# EAGLE design Atmega2560 (EAGLE 6.4)
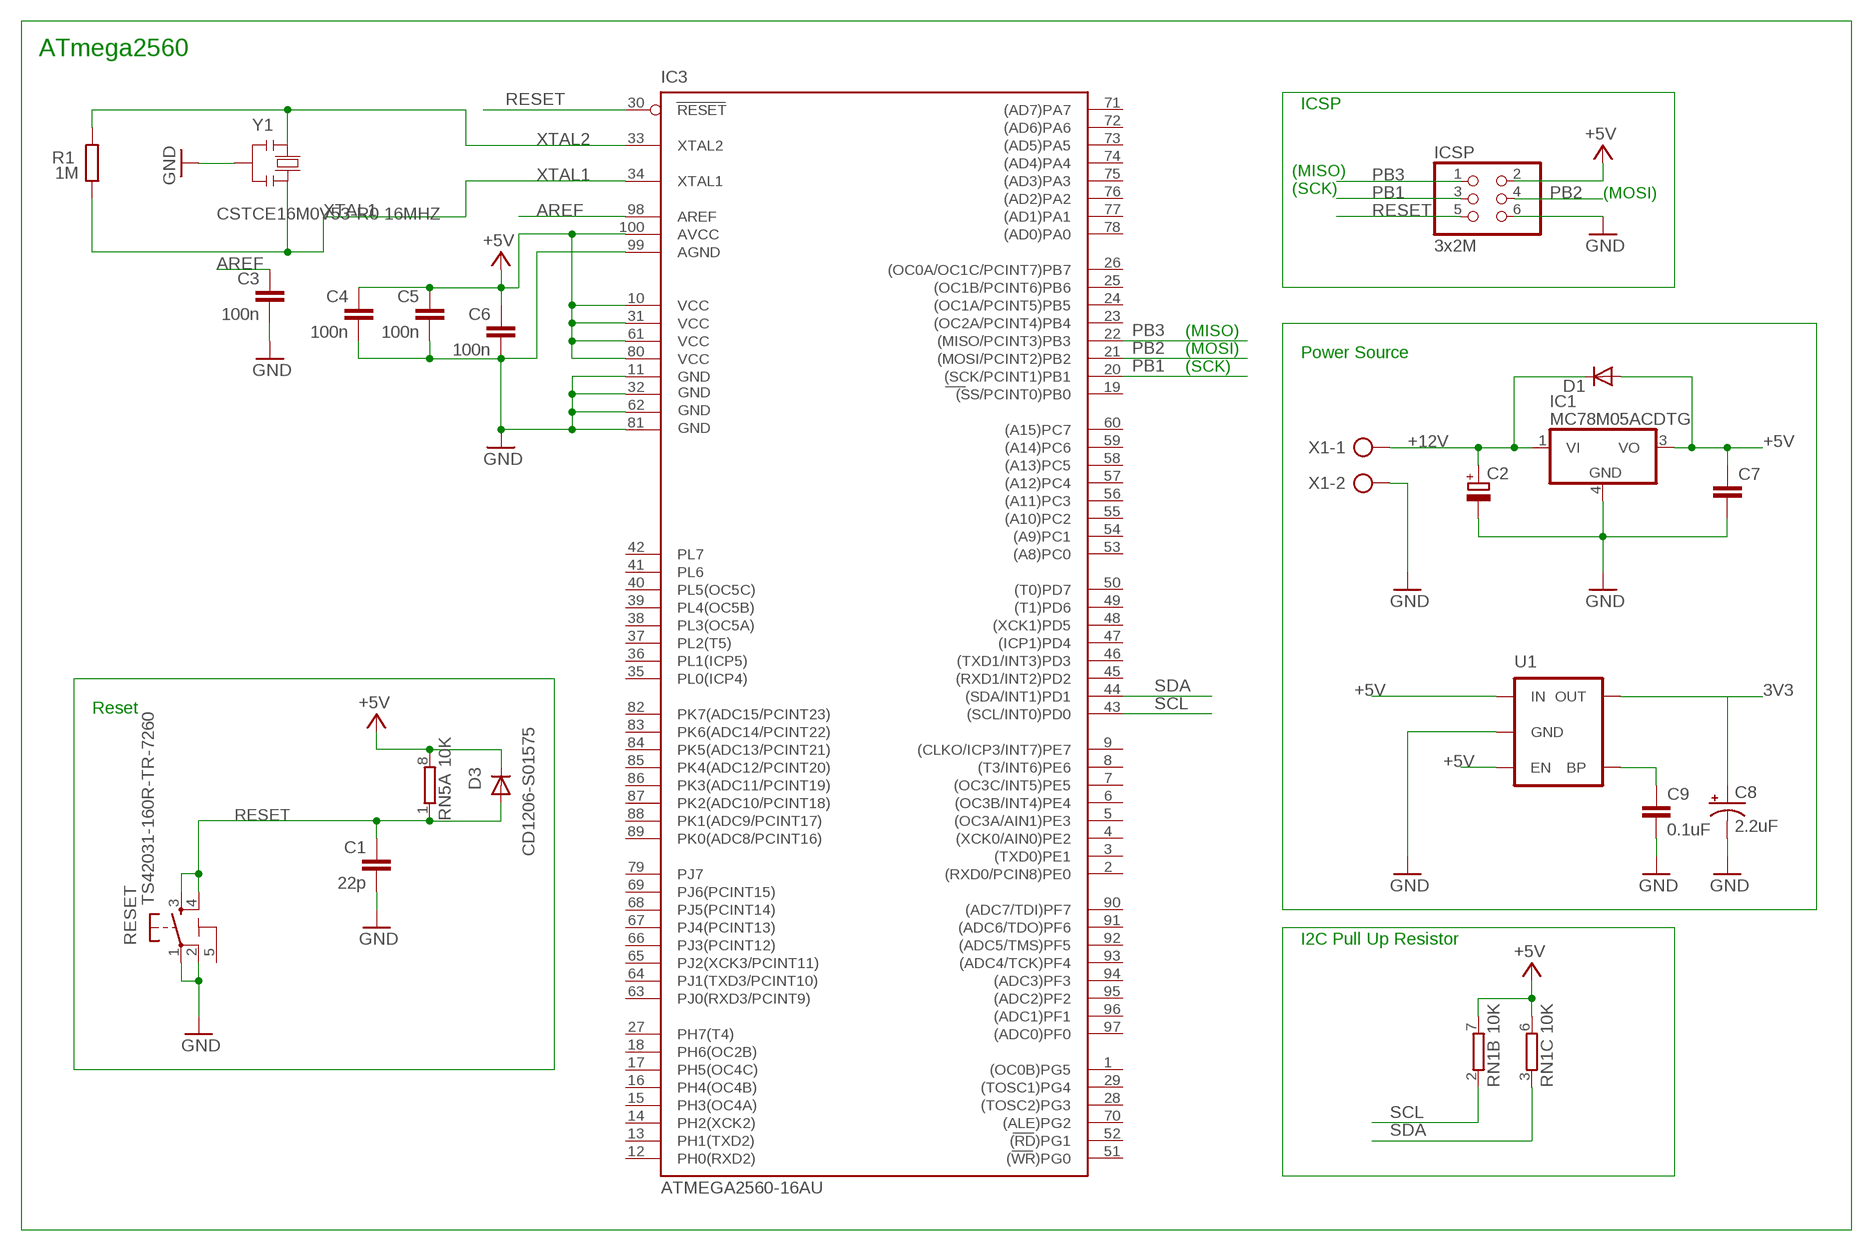
[diagram p0: schematic, sheet 1]

## Parts
C1  22p  C-EU0603-RND  [C0603-ROUND]
C2  CPOL-EUE5-13  [E5-13]
C3  100n  C-EU0603-RND  [C0603-ROUND]
C4  100n  C-EU0603-RND  [C0603-ROUND]
C5  100n  C-EU0603-RND  [C0603-ROUND]
C6  100n  C-EU0603-RND  [C0603-ROUND]
C7  CAPPTH  [CAP-PTH-SMALL]
C8  2.2uF  10UF-TANT  [EIA3216]
C9  0.1uF  0.1UF-25V(+80/-20%)(0603)  [0402-CAP]
D1  DIODESMA-KIT  [SMA-DIODE-KIT]
D3  CD1206-S01575  DIODE-MINIMELF  [MINIMELF]
IC1  MC78M05ACDTG  [DPACK_3]
IC3  ATMEGA2560-16AU  ATMEGA25602560-16AU  [TQFP100]
ICSP  3x2M  PINHD-2X3  [2X03]
R1  1M  R-EU_R0603  [R0603-ROUND]
RESET  TS42031-160R-TR-7260  TS42  [TS42]
RN1  10K  4R-NCAT16  [CAT16]
RN5  10K  4R-NCAT16  [CAT16]
U1  MIC52053.3V  [SOT23-5]
X1  AK500/2  [AK500/2]
Y1  CSTCE16M0V53-R0 16MHZ  RESONATORMU  [RESONATOR]

## Nets
3V3: C8.A(+) U1.5(OUT)
+5V [power usb]: C4.1 C5.1 C6.1 C7.1 D1.A D3.C IC1.3(VO) IC3.10(VCC) IC3.31(VCC1) IC3.61(VCC2) IC3.80(VCC3) IC3.100(AVCC) ICSP.2 RN1.6 RN1.7 RN5.8 U1.1(IN) U1.3(EN)
+12V: C2.+ D1.C IC1.1(VI) X1.1
AREF: C3.1 IC3.98(AREF)
GND [gnd]: C1.2 C2.- C3.2 C4.2 C5.2 C6.2 C7.2 C8.C(-) C9.2 IC1.4(GND) IC3.11(GND) IC3.32(GND1) IC3.62(GND2) IC3.81(GND3) IC3.99(AGND) ICSP.6 RESET.1 RESET.2 U1.2(GND) X1.2 Y1.2
N$5: C9.1 U1.4(BP)
PB1: IC3.20((SCK/PCINT1)PB1) ICSP.3
PB2: IC3.21((MOSI/PCINT2)PB2) ICSP.4
PB3: IC3.22((MISO/PCINT3)PB3) ICSP.1
RESET: C1.1 D3.A IC3.30(RESET) ICSP.5 RESET.3 RESET.4 RN5.1
SCL: IC3.43((SCL/INT0)PD0) RN1.2
SDA: IC3.44((SDA/INT1)PD1) RN1.3
XTAL1: IC3.34(XTAL1) R1.1 Y1.3
XTAL2: IC3.33(XTAL2) R1.2 Y1.1
Unconnected: IC3.1((OC0B)PG5) IC3.2((RXD0/PCIN8)PE0) IC3.3((TXD0)PE1) IC3.4((XCK0/AIN0)PE2) IC3.5((OC3A/AIN1)PE3) IC3.6((OC3B/INT4)PE4) IC3.7((OC3C/INT5)PE5) IC3.8((T3/INT6)PE6) IC3.9((CLKO/ICP3/INT7)PE7) IC3.12(PH0(RXD2)) IC3.13(PH1(TXD2)) IC3.14(PH2(XCK2)) IC3.15(PH3(OC4A)) IC3.16(PH4(OC4B)) IC3.17(PH5(OC4C)) IC3.18(PH6(OC2B)) IC3.19((SS/PCINT0)PB0) IC3.23((OC2A/PCINT4)PB4) IC3.24((OC1A/PCINT5)PB5) IC3.25((OC1B/PCINT6)PB6) IC3.26((OC0A/OC1C/PCINT7)PB7) IC3.27(PH7(T4)) IC3.28((TOSC2)PG3) IC3.29((TOSC1)PG4) IC3.35(PL0(ICP4)) IC3.36(PL1(ICP5)) IC3.37(PL2(T5)) IC3.38(PL3(OC5A)) IC3.39(PL4(OC5B)) IC3.40(PL5(OC5C)) IC3.41(PL6) IC3.42(PL7) IC3.45((RXD1/INT2)PD2) IC3.46((TXD1/INT3)PD3) IC3.47((ICP1)PD4) IC3.48((XCK1)PD5) IC3.49((T1)PD6) IC3.50((T0)PD7) IC3.51((WR)PG0) IC3.52((RD)PG1) IC3.53((A8)PC0) IC3.54((A9)PC1) IC3.55((A10)PC2) IC3.56((A11)PC3) IC3.57((A12)PC4) IC3.58((A13)PC5) IC3.59((A14)PC6) IC3.60((A15)PC7) IC3.63(PJ0(RXD3/PCINT9)) IC3.64(PJ1(TXD3/PCINT10)) IC3.65(PJ2(XCK3/PCINT11)) IC3.66(PJ3(PCINT12)) IC3.67(PJ4(PCINT13)) IC3.68(PJ5(PCINT14)) IC3.69(PJ6(PCINT15)) IC3.70((ALE)PG2) IC3.71((AD7)PA7) IC3.72((AD6)PA6) IC3.73((AD5)PA5) IC3.74((AD4)PA4) IC3.75((AD3)PA3) IC3.76((AD2)PA2) IC3.77((AD1)PA1) IC3.78((AD0)PA0) IC3.79(PJ7) IC3.82(PK7(ADC15/PCINT23)) IC3.83(PK6(ADC14/PCINT22)) IC3.84(PK5(ADC13/PCINT21)) IC3.85(PK4(ADC12/PCINT20)) IC3.86(PK3(ADC11/PCINT19)) IC3.87(PK2(ADC10/PCINT18)) IC3.88(PK1(ADC9/PCINT17)) IC3.89(PK0(ADC8/PCINT16)) IC3.90((ADC7/TDI)PF7) IC3.91((ADC6/TDO)PF6) IC3.92((ADC5/TMS)PF5) IC3.93((ADC4/TCK)PF4) IC3.94((ADC3)PF3) IC3.95((ADC2)PF2) IC3.96((ADC1)PF1) IC3.97((ADC0)PF0) RN1.1 RN1.4 RN1.5 RN1.8 RN5.2 RN5.3 RN5.4 RN5.5 RN5.6 RN5.7

## Notes on the sheet
- ATmega2560
- ICSP
- (MISO)
- (SCK) | (MOSI)
- (MISO)
- (MOSI) | Power Source
- (SCK)
- Reset
- I2C Pull Up Resistor

## Power pins joined to a net without a drawn wire
5-GND: RESET.5(5-GND)

## Library data of the parts
C1 C3-C6 = SmartPrj:C-EU: CAPACITOR, European symbol
C2 = rcl:CPOL-EU: POLARIZED CAPACITOR, European symbol
C7 = SparkFun-Capacitors:CAP: Capacitor Standard 0603 ceramic capacitor, and 0.1" leaded capacitor.
C8 = SparkFun-Capacitors:10UF-TANT: 10uF Tantalum SMT CAP-00811- 16V 10% (EIA-3216); PROD_ID: CAP-00811; VALUE: 10uF
C9 = SparkFun-Capacitors:0.1UF-25V(+80/-20%)(0603): Ceramic Standard decoupling cap CAP-00810; PROD_ID: CAP-00810
D1 = SparkFun-DiscreteSemi:DIODE: Diode These are standard reverse protection diodes and small signal diodes. SMA package can handle up to about 1A. SOD-323 can handle about 200mA. What the SOD-323 package when ordering, there are some mfgs out there that are 5-pin packages.
D3 = diode:DIODE-: DIODE
IC1 = linear:MC78M: 500 mA Positive Voltage Regulators Source: Data sheet <http://www.onsemi.com/pub_link/Collateral/MC78M00-D.PDF>
IC3 = SmartPrj:ATMEGA2560: MICROCONTROLLER 64/128/256 Kbytes FLASH 4 Kbytes EEPROM 8 Kbytes SRAM 86 General Purpose I/O pins 12-channels16-bit PWM 4 x Serial USARTs 16-channels 10-bit A/D
ICSP = SmartPrj:PINHD-2X3: PIN HEADER
R1 = SmartPrj:R-EU_: RESISTOR, European symbol
RESET = SmartPrj:TS42: TS42 Dongnan Electronics Tact switch VDC 12V - 50mA
RN1 RN5 = resistor-dil:4R-N: Array Chip Resistor Source: RS Component / Phycomp
U1 = SparkFun-PowerIC:MIC5205: MIC5205 150mA vreg 3.3V - VREG-00822 5V - VREG-00823; PROD_ID: VREG-00822
X1 = con-ptr500:AK500/2: CONNECTOR; OC_FARNELL: unknown; OC_NEWARK: unknown
Y1 = SmartPrj:RESONATOR

## Net classes
0 default: width 0.203 mm, drill 0.406 mm, clearance 0.203 mm
1 power: width 0.61 mm, drill 0.406 mm, clearance 0.203 mm
2 gnd: width 0.305 mm, drill 0.406 mm, clearance 0.203 mm
3 power usb: width 0.508 mm, drill 0.406 mm, clearance 0.203 mm

## Board
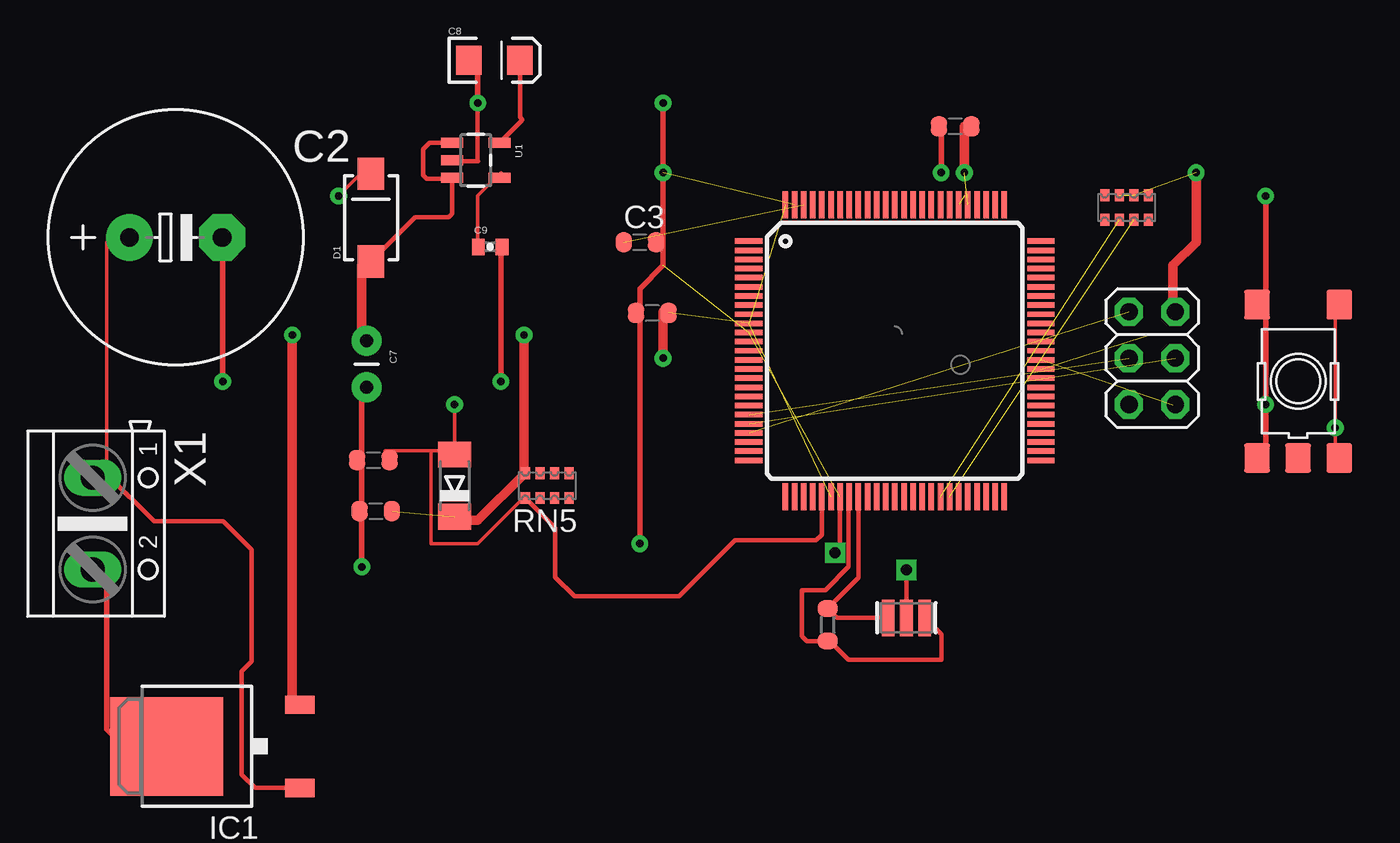
[diagram p1: board, top side]
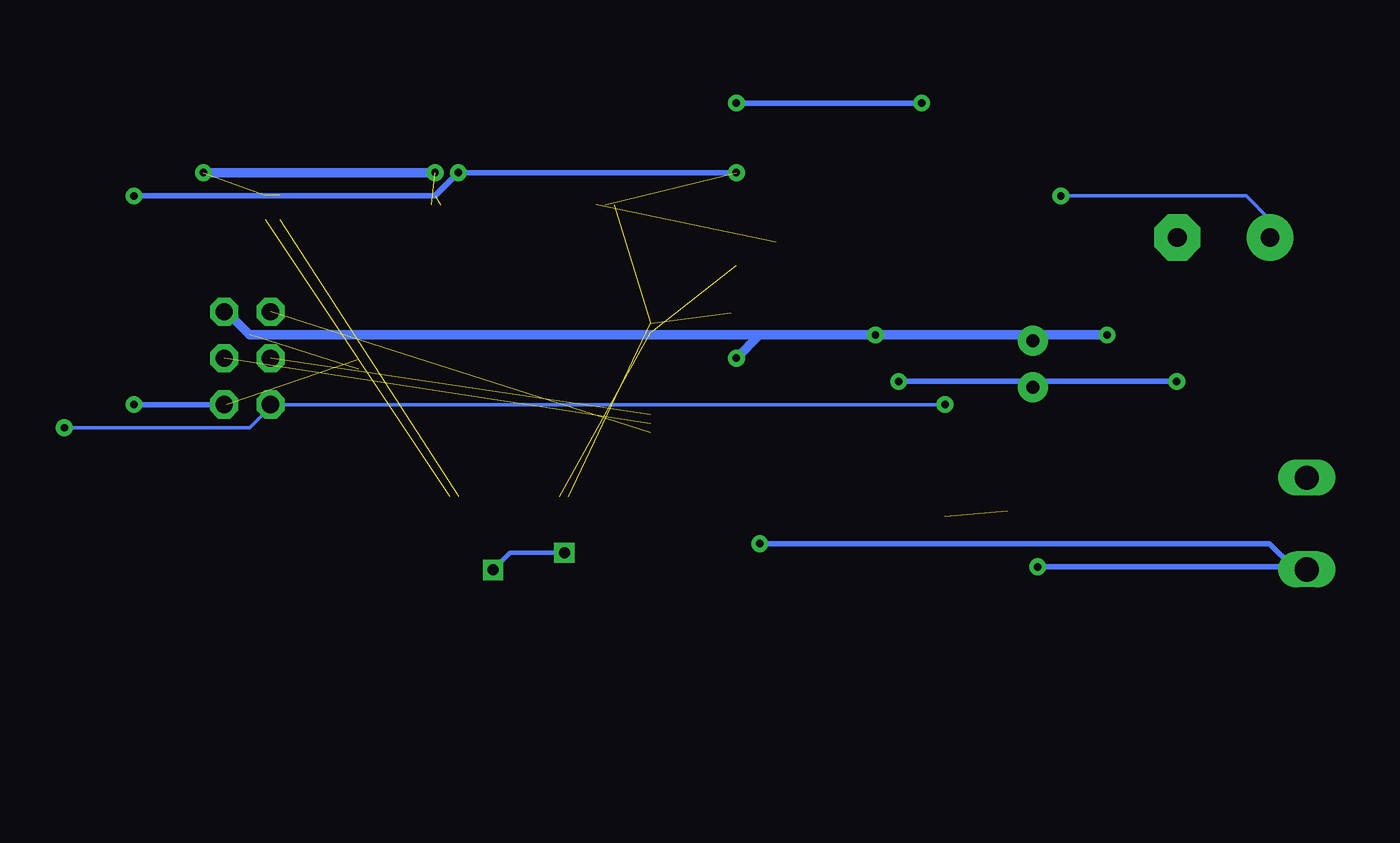
[diagram p2: board, bottom side, seen from below]

No outline drawn. Coordinates in mm, seen from the top.
Copper layers (1*16): Top 0.035mm / dielectric 1.5mm / Bottom 0.035mm
Design rules "default": minimum track width 8mil, minimum drill 16mil, track to track 7mil, track to pad 7mil, pad to pad 8mil, via to via 10mil, smd to smd 7mil, copper to edge 27mil, drill to drill 12mil, minimum pad ring 10mil, minimum via ring 10mil, stop-mask expansion 2mil, vias tented up to drill 24mil, thermal gap 10mil

### Footprints (pad centres in the part's own frame; a part is rotated, then mirrored left to right if it is on the bottom)
C0603-ROUND = smd 0.898 x 1.1: 1 -0.889,0; 2 0.889,0
E5-13 = drill 1.016 pad 2.54: + -2.54,0 | drill 1.016 pad 2.54 octagon: - 2.54,0
CAP-PTH-SMALL = drill 0.7 pad 1.651: 1 0,0; 2 2.54,0
EIA3216 = smd 1.4 x 1.6: A 1.4,0; C -1.4,0
0402-CAP = smd 0.7 x 0.9: 1 -0.65,0; 2 0.65,0
SMA-DIODE-KIT = smd 1.77 x 1.47: A -2.4,0; C 2.4,0
MINIMELF = smd 1.4 x 1.8: A 1.7,0; C -1.7,0
DPACK_3 = smd 1 x 1.6: 1 -2.28,-4.8; 3 2.28,-4.8 | smd 5.4 x 6.2: 4 0,2.5
TQFP100 = smd 1.5 x 0.3: 1 -8,6; 2 -8,5.5; 3 -8,5; 4 -8,4.5; 5 -8,4; 6 -8,3.5; 7 -8,3; 8 -8,2.5; 9 -8,2; 10 -8,1.5; 11 -8,1; 12 -8,0.5; 13 -8,0; 14 -8,-0.5; 15 -8,-1; 16 -8,-1.5; 17 -8,-2; 18 -8,-2.5; 19 -8,-3; 20 -8,-3.5; 21 -8,-4; 22 -8,-4.5; 23 -8,-5; 24 -8,-5.5; 25 -8,-6; 51 8,-6; 52 8,-5.5; 53 8,-5; 54 8,-4.5; 55 8,-4; 56 8,-3.5; 57 8,-3; 58 8,-2.5; 59 8,-2; 60 8,-1.5; 61 8,-1; 62 8,-0.5; 63 8,0; 64 8,0.5; 65 8,1; 66 8,1.5; 67 8,2; 68 8,2.5; 69 8,3; 70 8,3.5; 71 8,4; 72 8,4.5; 73 8,5; 74 8,5.5; 75 8,6 | smd 0.3 x 1.5: 26 -6,-8; 27 -5.5,-8; 28 -5,-8; 29 -4.5,-8; 30 -4,-8; 31 -3.5,-8; 32 -3,-8; 33 -2.5,-8; 34 -2,-8; 35 -1.5,-8; 36 -1,-8; 37 -0.5,-8; 38 0,-8; 39 0.5,-8; 40 1,-8; 41 1.5,-8; 42 2,-8; 43 2.5,-8; 44 3,-8; 45 3.5,-8; 46 4,-8; 47 4.5,-8; 48 5,-8; 49 5.5,-8; 50 6,-8; 76 6,8; 77 5.5,8; 78 5,8; 79 4.5,8; 80 4,8; 81 3.5,8; 82 3,8; 83 2.5,8; 84 2,8; 85 1.5,8; 86 1,8; 87 0.5,8; 88 0,8; 89 -0.5,8; 90 -1,8; 91 -1.5,8; 92 -2,8; 93 -2.5,8; 94 -3,8; 95 -3.5,8; 96 -4,8; 97 -4.5,8; 98 -5,8; 99 -5.5,8; 100 -6,8
2X03 = drill 0.95 pad 1.55 octagon: 1 -2.54,-1.27; 2 -2.54,1.27; 3 0,-1.27; 4 0,1.27; 5 2.54,-1.27; 6 2.54,1.27
R0603-ROUND = smd 0.898 x 1.1: 1 -0.889,0; 2 0.889,0
TS42 = smd 1.6 x 1.4: 1 -4.2,2.25; 2 4.2,2.25; 3 -4.2,-2.25; 4 4.2,-2.25; 5 -4.2,0
CAT16 = smd 0.5 x 0.65: 1 -1.2,-0.675; 2 -0.4,-0.675; 3 0.4,-0.675; 4 1.2,-0.675; 5 1.2,0.675; 6 0.4,0.675; 7 -0.4,0.675; 8 -1.2,0.675
SOT23-5 = smd 0.55 x 1.2: 1 -0.95,-1.3; 2 0,-1.3; 3 0.95,-1.3; 4 0.95,1.3; 5 -0.95,1.3
AK500/2 = drill 1.321 long: 1 -2.515,0; 2 2.515,0
RESONATOR = smd 0.7 x 2: 1 -1,0; 2 0,0; 3 1,0

### Placement (x,y rotation side)
C1  22.23,22.35 180 top
C2  11.4,34.56 0 top
C3  36.83,34.29 0 top
C4  22.35,19.56 180 top
C5  54.1,40.64 180 top
C6  37.51,30.42 180 top
C7  21.85,28.89 270 top
C8  28.86,44.26 0 top
C9  28.63,34.04 0 top
D1  22.09,35.64 90 top
D3  26.67,20.95 90 top
IC1  13.4,6.68 90 top
IC3  50.8,28.35 0 top
ICSP  64.9,27.94 270 top
R1  47.12,13.34 270 top
RESET  72.9,26.67 90 top
RN1  63.5,36.2 0 top
RN5  31.75,20.95 0 top
U1  27.84,38.78 270 top
X1  6.84,18.88 270 top
Y1  51.44,13.72 180 top

### Tracks (layer width: path | path; a pad name or v marks a point on that pad's centre or on a via)
3V3
  Top 0.254: U1.5 30.37,40.96 30.37,41.02 30.26,41.13 C8.A
+5V  (via drill 0.41)  (8 unrouted)
  Top 0.254: D1.A 24.52,35.67 26.35,35.67 26.54,35.86 U1.3 26.47,37.76 25.14,37.76 24.94,37.96 24.94,39.37 25.3,39.73 U1.1
  Top 0.508: v54.61,38.1 54.61,40.64 C5.1 | v67.31,38.1 67.31,34.29 66.04,33.02 66.04,30.48 ICSP.2 | 30.48,21.59 27.94,19.05 26.67,19.05 D3.C | v38.1,27.94 38.1,30.48 C6.1 | v17.78,29.21 17.78,8.89 IC1.3 | D1.A 21.59,33.02 21.59,29.21 C7.1 | v30.48,29.21 30.48,21.59 | 30.48,21.59 RN5.8
  Bottom 0.508: v67.31,38.1 v54.61,38.1 | 36.83,29.21 v38.1,27.94 | 21.59,29.21 v30.48,29.21 36.83,29.21 | 21.59,29.21 v17.78,29.21 | 21.59,29.21 C7.1 | 36.83,29.21 64.77,29.21 66.04,30.48 ICSP.2
+12V  (via drill 0.41)
  Top 0.203: v20.32,36.83 21.59,38.1 D1.C | X1.1 7.62,21.59 7.62,34.29 C2.+
  Top 0.254: 7.62,21.59 10.21,19 13.99,19 15.56,17.43 15.56,11.34 15.02,10.8 15.02,5.13 15.75,4.4 IC1.1
  Bottom 0.203: v20.32,36.83 10.16,36.83 8.89,35.56 C2.+
AREF  (1 unrouted)
GND  (via drill 0.41, 0.6)  (5 unrouted)
  Top 0.254: Y1.2 v51.44,16.34 | v47.53,17.28 47.8,17.55 IC3.32 | U1.2 26.59,38.73 27.96,38.73 27.94,38.75 v27.94,41.91
  Top 0.305: 58.83,27.84 58.82,27.85 IC3.62 | X1.2 7.62,16.51 7.62,7.62 8.89,6.35 10.16,6.35 IC1.4 | 21.59,22.86 21.59,19.05 | v29.21,26.67 29.21,34.29 C9.2 | 21.59,22.86 21.59,26.67 C7.2 | 21.59,22.86 C1.2 | v13.97,26.67 13.97,34.29 C2.- | 21.59,19.05 v21.59,16.51 | 21.59,19.05 C4.2 | 71.12,30.48 v71.12,25.4 71.12,22.86 RESET.1 | 36.83,30.48 36.83,31.75 38.1,33.02 38.1,34.29 | v53.34,38.1 53.34,40.64 C5.2 | 38.1,34.29 v38.1,38.1 v38.1,41.91 | 38.1,34.29 C3.2 | v27.94,41.91 27.94,44.45 C8.C | v71.12,36.83 71.12,30.48 | 71.12,30.48 RESET.2 | 36.83,30.48 v36.83,17.78 | 36.83,30.48 C6.2
  Bottom 0.254: v51.44,16.34 50.5,17.28 v47.53,17.28
  Bottom 0.305: 21.59,26.67 v29.21,26.67 | 21.59,26.67 v13.97,26.67 | 21.59,26.67 C7.2 | v21.59,16.51 7.62,16.51 | v71.12,25.4 ICSP.6 66.04,25.4 | v38.1,38.1 v53.34,38.1 54.61,36.83 v71.12,36.83 | v38.1,41.91 v27.94,41.91 | 7.62,16.51 8.89,17.78 v36.83,17.78 | 7.62,16.51 X1.2
N$5
  Top 0.203: C9.1 27.94,34.29 27.94,36.83 29.21,38.1 U1.4
PB1  (1 unrouted)
PB2  (1 unrouted)
PB3  (1 unrouted)
RESET  (via drill 0.41)
  Top 0.203: 25.4,22.86 25.4,17.78 27.94,17.78 30.48,20.32 RN5.1 | 26.67,22.86 25.4,22.86 | 25.4,22.86 22.86,22.86 C1.1 | RESET.3 74.93,22.86 v74.93,24.13 74.93,30.48 RESET.4 | v26.67,25.4 26.67,22.86 | 26.67,22.86 D3.A
  Top 0.254: RN5.1 32.18,18.65 32.18,15.95 33.24,14.89 38.97,14.89 42.05,17.96 46.49,17.96 46.8,18.28 IC3.30
  Bottom 0.203: 63.5,25.4 64.77,24.13 v74.93,24.13 | 63.5,25.4 v26.67,25.4 | 63.5,25.4 ICSP.5
SCL  (1 unrouted)
SDA  (1 unrouted)
XTAL1
  Top 0.254: Y1.3 47.62,13.72 R1.1 48.8,15.91 IC3.34
XTAL2
  Top 0.254: Y1.1 53.34,12.81 53.34,11.43 48.26,11.43 47.24,12.45 R1.2 45.97,12.45 45.72,12.7 45.72,15.24 46.99,15.24 48.26,16.51 48.26,20.31 IC3.33